# EAGLE design esp8266-breakout (EAGLE 9.5.2)
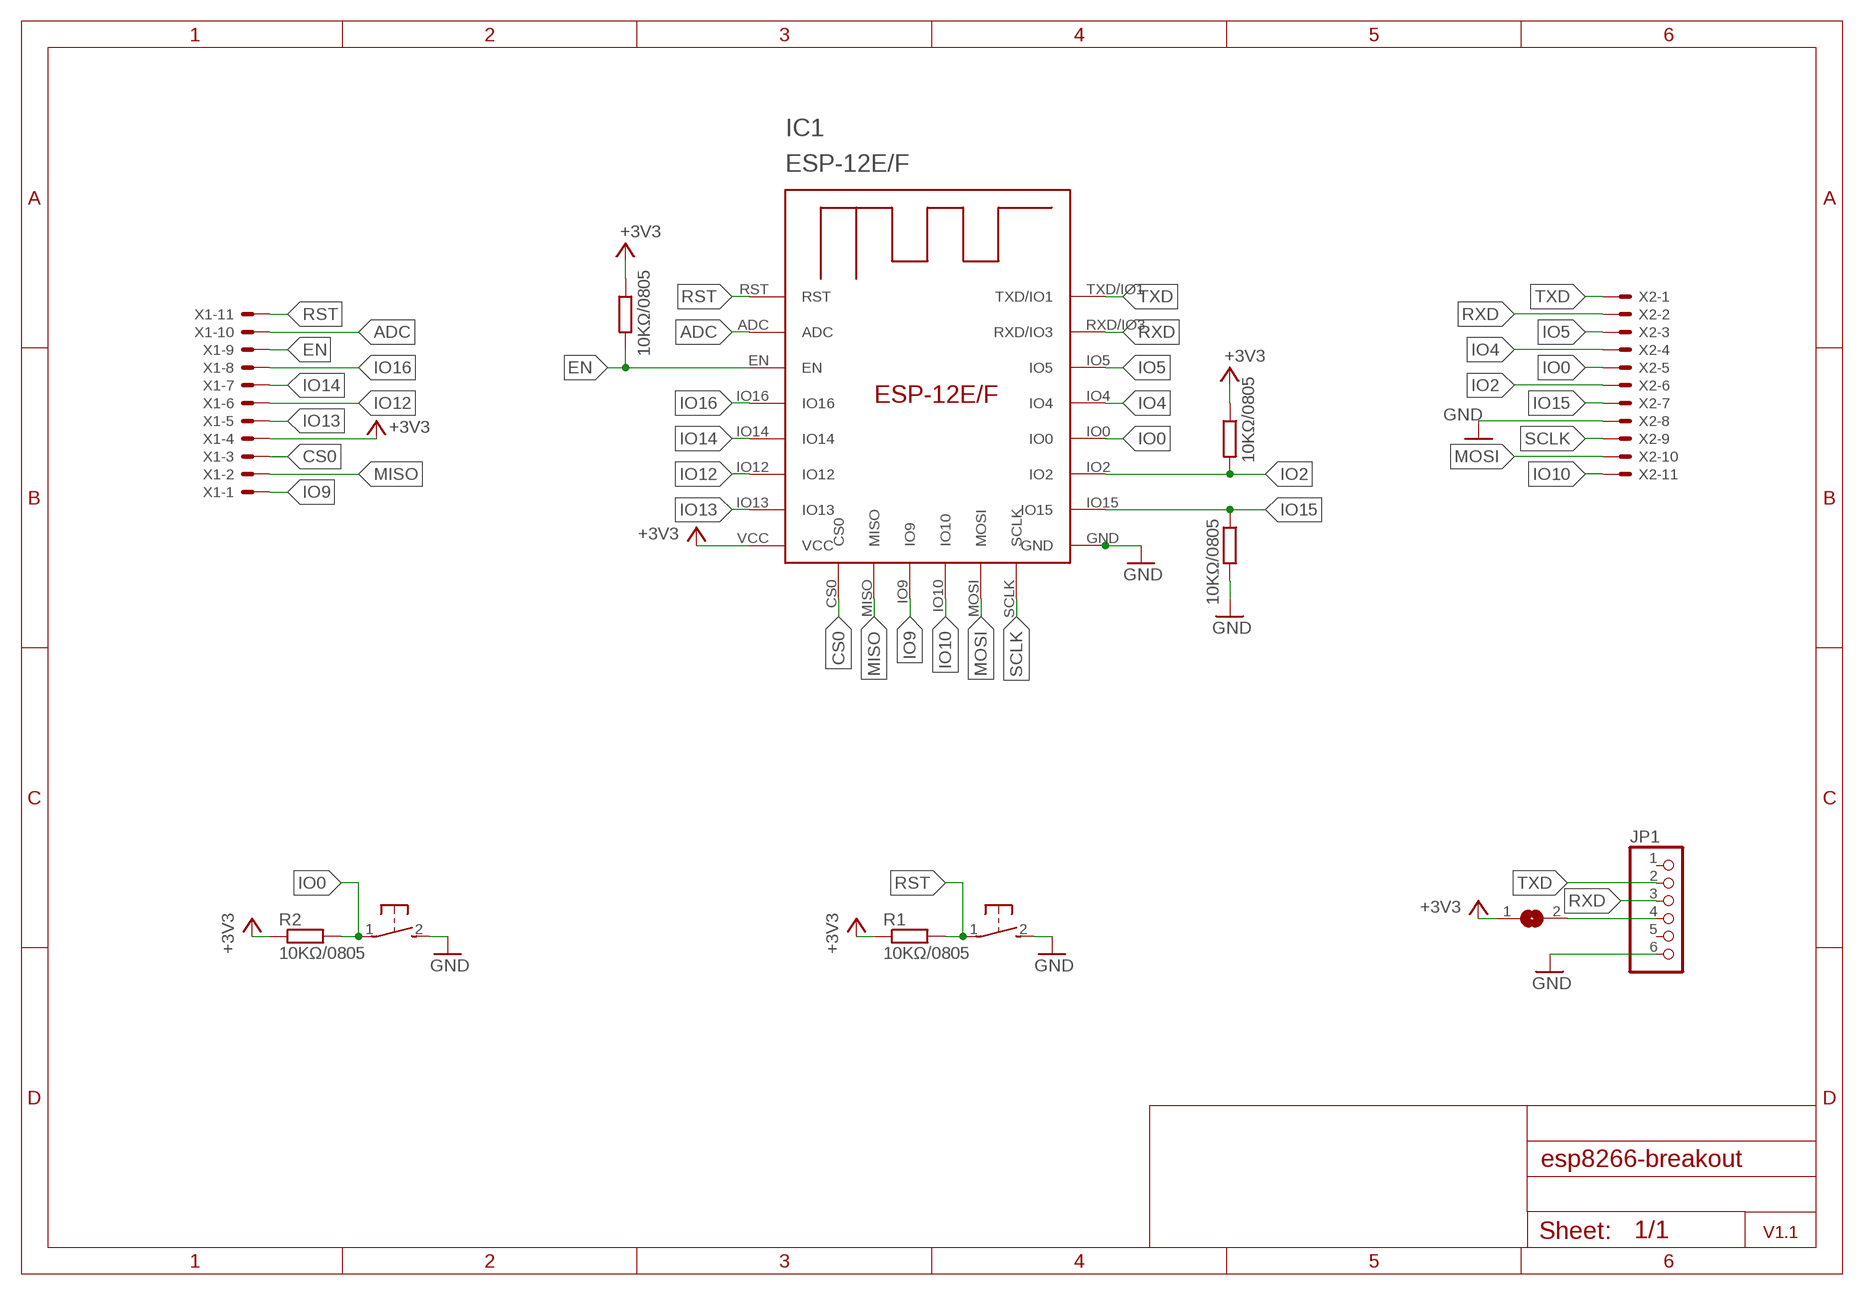
[diagram p0: schematic, sheet 1]

## Parts
IC1  ESP-12E/F  [ESP-12E]
JP1  PINHD-1X6B  [1X06-BIG]
R1  10KΩ/0805  R-EU_R0805  [R0805]
R2  10KΩ/0805  R-EU_R0805  [R0805]
R3  10KΩ/0805  R-EU_R0805  [R0805]
R4  10KΩ/0805  R-EU_R0805  [R0805]
R5  10KΩ/0805  R-EU_R0805  [R0805]
S1  DTSM-3  [DTSM-3]
S2  DTSM-3  [DTSM-3]
SJ1  SJ  [SJ]
X1  JST-XH-11-PIN-ROUND-PAD  [JST-XH-11-PACKAGE-ROUND-PAD]
X2  JST-XH-11-PIN-ROUND-PAD  [JST-XH-11-PACKAGE-ROUND-PAD]

## Nets
+3V3: IC1.VCC R1.1 R2.1 R4.1 R5.1 SJ1.1 X1.4
ADC: IC1.ADC X1.10
CS0: IC1.CS0 X1.3
EN: IC1.EN R5.2 X1.9
GND: IC1.GND JP1.6 R3.2 S1.2 S2.2 X2.8
IO0: IC1.IO0 R2.2 S2.1 X2.5
IO2: IC1.IO2 R4.2 X2.6
IO4: IC1.IO4 X2.4
IO5: IC1.IO5 X2.3
IO9: IC1.IO9 X1.1
IO10: IC1.IO10 X2.11
IO12: IC1.IO12 X1.6
IO13: IC1.IO13 X1.5
IO14: IC1.IO14 X1.7
IO15: IC1.IO15 R3.1 X2.7
IO16: IC1.IO16 X1.8
MISO: IC1.MISO X1.2
MOSI: IC1.MOSI X2.10
N$1: JP1.4 SJ1.2
RST: IC1.RST R1.2 S1.1 X1.11
RXD: IC1.RXD/IO3 JP1.3 X2.2
SCLK: IC1.SCLK X2.9
TXD: IC1.TXD/IO1 JP1.2 X2.1
Unconnected: JP1.1 JP1.5

## Notes on the sheet
- V1.1

## Library data of the parts
IC1 = esp-12e-f:ESP-12E/F
JP1 = adafruit:PINHD-1X6: PIN HEADER
R1-R5 = rcl:R-EU_: RESISTOR, European symbol; SPICEPREFIX: R
S1 S2 = switch-tact:DTSM-3
SJ1 = jumper:SJ: SMD solder JUMPER
X1 X2 = JST-XH:JST-XH-11-PIN: JST XH Connector 2 Pin Wire to board connector. Pitch: 2,54 mm, (0.100") Number of pins: 11 Created by Rembrandt Electronics www.rembrandtelectronics.com

## Board
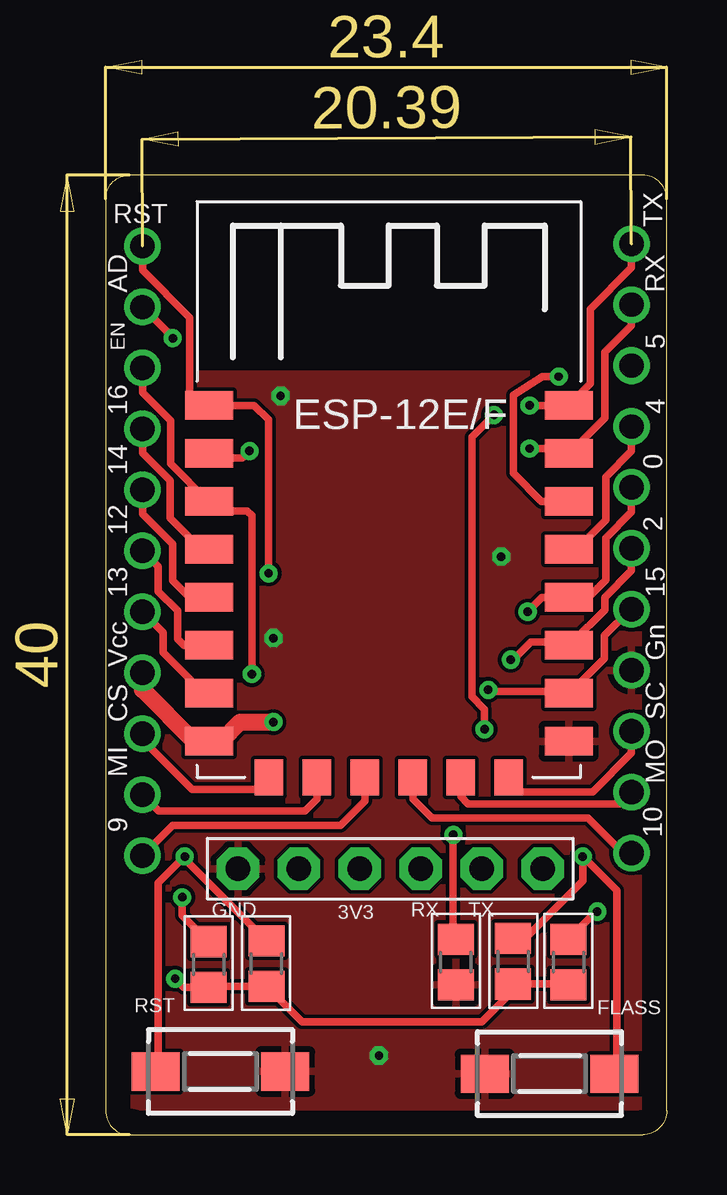
[diagram p1: board, top side]
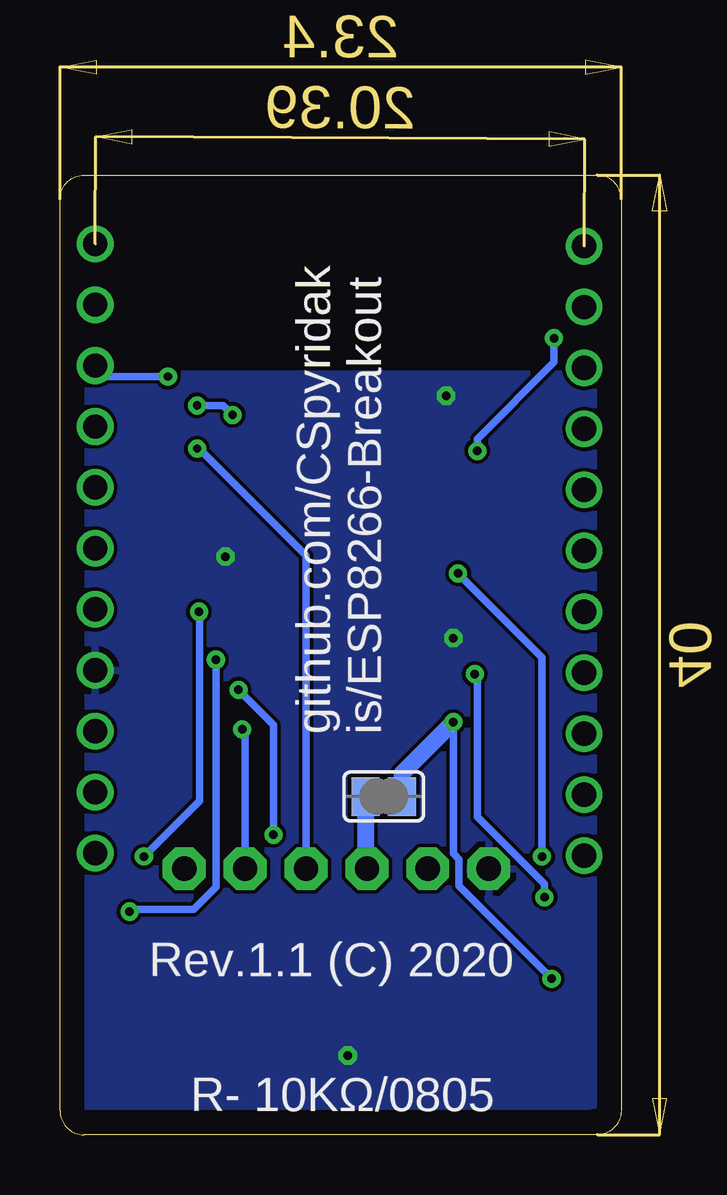
[diagram p2: board, bottom side, seen from below]

Size 23.4 x 40 mm. Coordinates in mm from the lower left corner, seen from the top.
Outline: 1,0 22.4,0 arc90 23.4,1 23.4,39 arc90 22.4,40 1,40 arc90 0,39 0,1 arc90 1,0
Copper layers (1*16): Top 0.035mm / dielectric 1.5mm / Bottom 0.035mm
Design rules "default": minimum track width 6mil, minimum drill 0.35mm, track to track 6mil, track to pad 6mil, pad to pad 6mil, via to via 6mil, smd to smd 6mil, copper to edge 40mil, drill to drill 6mil, minimum pad ring 10mil, minimum via ring 8mil, stop-mask expansion 4mil, vias tented up to drill 0mil, thermal gap 10mil

### Footprints (pad centres in the part's own frame; a part is rotated, then mirrored left to right if it is on the bottom)
ESP-12E = smd 2 x 1.2: ADC -7.46,5.53; EN -7.46,3.53; GND 7.54,-6.47; IO0 7.54,-0.47; IO2 7.54,-2.47; IO4 7.54,1.53; IO5 7.54,3.53; IO12 -7.46,-2.47; IO13 -7.46,-4.47; IO14 -7.46,-0.47; IO15 7.54,-4.47; IO16 -7.46,1.53; RST -7.46,7.53; RXD/IO3 7.54,5.53; TXD/IO1 7.54,7.53; VCC -7.46,-6.47 | smd 1.2 x 1.5: CS0 -4.96,-7.97; IO9 -0.96,-7.97; IO10 1.04,-7.97; MISO -2.96,-7.97; MOSI 3.04,-7.97; SCLK 5.04,-7.97
1X06-BIG = drill 1.016 pad 1.778 octagon: 1 -6.35,0; 2 -3.81,0; 3 -1.27,0; 4 1.27,0; 5 3.81,0; 6 6.35,0
R0805 = smd 1.3 x 1.5: 1 -0.95,0; 2 0.95,0
DTSM-3 = smd 2 x 1.6: 1 -2.7,0; 2 2.7,0
SJ = smd 1.168 x 1.6: 1 -0.762,0; 2 0.762,0
JST-XH-11-PACKAGE-ROUND-PAD = drill 1.016: 1 -12.7,0; 2 -10.16,0; 3 -7.62,0; 4 -5.08,0; 5 -2.54,0; 6 0,0; 7 2.54,0; 8 5.08,0; 9 7.62,0; 10 10.16,0; 11 12.7,0

### Placement (x,y rotation side)
IC1  11.77,22.87 0 top
JP1  11.87,11.09 180 top
R1  6.71,7.13 90 top
R2  16.99,7.23 90 top
R3  14.6,7.2 270 top
R4  19.3,7.2 90 top
R5  4.3,7.1 90 top
S1  4.79,2.64 0 top
S2  18.51,2.54 180 top
SJ1  9.9,14.1 180 bottom
X1  1.54,24.34 90 top
X2  21.93,24.44 270 top

### Tracks (layer width: path | path; a pad name or v marks a point on that pad's centre or on a via)
+3V3  (via drill 0.35)
  Top 0.305: R4.1 19.27,6.28 R2.1 16.99,5.99 15.7,4.7 8.19,4.7 R1.1 4.33,6.18 R5.1 3.25,6.15 v2.9,6.5
  Top 0.7: v7,17.2 5.62,17.2 4.82,16.4 IC1.VCC 3.7,16.4 1.54,18.56 X1.4
  Bottom 0.305: v7,17.2 7,11.72 6.77,11.48 6.77,10.37 v2.9,6.5
  Bottom 0.7: v7,17.2 9.14,15.06 SJ1.1
ADC  (via drill 0.35)
  Top 0.305: X1.10 2.8,33.24 v2.8,33.2 | v6,28.5 5.7,28.2 4.51,28.2 IC1.ADC
  Bottom 0.305: v2.8,33.2 2.8,32.2 6,29 v6,28.5
CS0
  Top 0.305: X1.3 1.54,16.46 3.6,14.4 6.8,14.4 6.81,14.41 IC1.CS0
EN  (via drill 0.35)
  Top 0.305: X1.9 1.54,30.93 2.71,29.76 2.71,27.97 4.28,26.4 IC1.EN 4.71,26 5.9,26 6.1,25.8 v6.1,19.2 | v3.2,9.9 3.2,9.15 R5.2
  Bottom 0.305: v3.2,9.9 3.2,10.46 6,13.26 6,19.1 v6.1,19.2
GND  (via drill 0.35)
  other vias: 11.4,3.3 16.5,24.1 7,20.7 7.3,30.8
  pour Top: -0.7,31.7 23.65,31.7 24,31.35 24,0.4 23,-0.6 0.5,-0.6 -0.7,0.6
  pour Bottom: -0.6,31.7 23.8,31.7 23.7,31.6 24,31.3 24,0.4 22.9,-0.7 0.6,-0.7 -0.6,0.5
IO0  (via drill 0.35)
  Top 0.305: S2.1 21.31,2.64 21.31,10.19 v19.9,11.6 19.9,10.58 17.5,8.18 R2.2 | X2.5 21.93,25.95 20.86,24.88 20.86,23.12 20.14,22.4 IC1.IO0 18.2,22.4 v17.6,21.8
  Bottom 0.305: v19.9,11.6 17.58,13.92 17.58,21.64 17.6,21.66 v17.6,21.8
IO2  (via drill 0.35)
  Top 0.305: IC1.IO2 19.34,20.4 19.47,20.53 | 19.47,20.53 20.82,21.87 20.82,22.4 21.93,23.52 X2.6 | R4.2 20.45,9.3 v20.5,9.3 | v16.9,19.8 17,19.8 17.73,20.53 19.47,20.53
  Bottom 0.305: v16.9,19.8 16.9,10.32 17.83,9.4 20.4,9.4 v20.5,9.3
IO4
  Top 0.305: IC1.IO4 19.64,24.4 20.86,25.62 20.86,27.42 21.93,28.49 X2.4
IO5  (via drill 0.35)
  Top 0.305: IC1.IO5 18.18,26.4 17,27.58 17,30.83 18.21,31.6 v18.9,31.6
  Bottom 0.305: X2.3 21.47,31.6 v18.9,31.6
IO9
  Top 0.305: IC1.IO9 10.81,13.91 9.8,12.9 2.8,12.9 X1.1
IO10
  Top 0.305: X2.11 21.56,11.74 20.1,13.2 13.6,13.2 12.81,13.99 IC1.IO10
IO12
  Top 0.305: X1.6 2.2,23.68 2.2,22.65 3,21.84 3,20.67 3.28,20.4 IC1.IO12
IO13
  Top 0.305: X1.5 2.4,20.94 2.4,20.1 4.1,18.4 IC1.IO13
IO14
  Top 0.305: X1.7 1.54,25.88 2.8,24.62 2.8,23.1 3.5,22.4 IC1.IO14
IO15  (via drill 0.35)
  Top 0.305: X2.7 21.9,21.9 20.8,20.8 20.8,19.86 19.34,18.4 IC1.IO15 19.23,18.48 16.02,18.48 v15.96,18.54 | R3.1 14.49,8.26 14.49,12.49 v14.5,12.5
  Bottom 0.305: v14.5,12.5 14.5,17.09 v15.96,18.54
IO16
  Top 0.305: X1.8 1.54,28.42 2.7,27.26 2.7,25.7 4,24.4 IC1.IO16
MISO
  Top 0.305: X1.2 2.22,13.5 8.31,13.5 8.81,14 IC1.MISO
MOSI
  Top 0.305: X2.10 21.45,13.8 15.11,13.8 14.81,14.1 IC1.MOSI
N$1
  Bottom 0.7: SJ1.2 10.66,11.15 JP1.4
RST  (via drill 0.35)
  Top 0.305: S1.1 2.19,2.74 2.19,10.49 v3.3,11.6 3.3,11.49 R1.2 | v6.8,23.4 6.8,29.8 6.2,30.4 IC1.RST 3.91,30.4 3.51,30.8 3.51,34.07 1.54,36.04 X1.11
  Bottom 0.305: v3.3,11.6 3.3,19.9 v6.8,23.4
RXD  (via drill 0.35)
  Top 0.305: X2.2 21.93,33.73 20.82,32.62 20.82,29.87 19.34,28.4 IC1.RXD/IO3 19.11,28.6 v17.68,28.6
  Bottom 0.305: JP1.3 13.14,24.14 17.6,28.6 v17.68,28.6
SCLK
  Top 0.305: X2.9 21.93,15.92 20.31,14.3 17.21,14.3 16.81,14.7 IC1.SCLK
TXD  (via drill 0.35)
  Top 0.305: X2.1 21.93,36.14 20.21,34.42 20.21,31.3 IC1.TXD/IO1 v17.68,30.4 | v15.8,16.9 15.8,17.73 15.27,18.26 15.27,29.07 v16.2,30
  Bottom 0.305: JP1.2 15.68,16.78 v15.8,16.9 | v16.2,30 16.6,30.4 v17.68,30.4

### Text on the board
tPlace: TX | RST | AD | RX | EN | 5 | 4 | 16 | 14 | 0 | 2 | 12 | 15 | 13 | Gn | Vcc | SC | CS | MO | MI | 9 | 10 | GND | 3V3 | RX | TX | RST | FLASS
bNames: github.com/CSpyridak / is/ESP8266-Breakout | Rev.1.1 (C) 2020 | R- 10KΩ/0805